# Altium schematic sheet ant_amplifier.SchDoc
size 431 x 279 mm; SheetNumber: 1; SheetTotal: 1
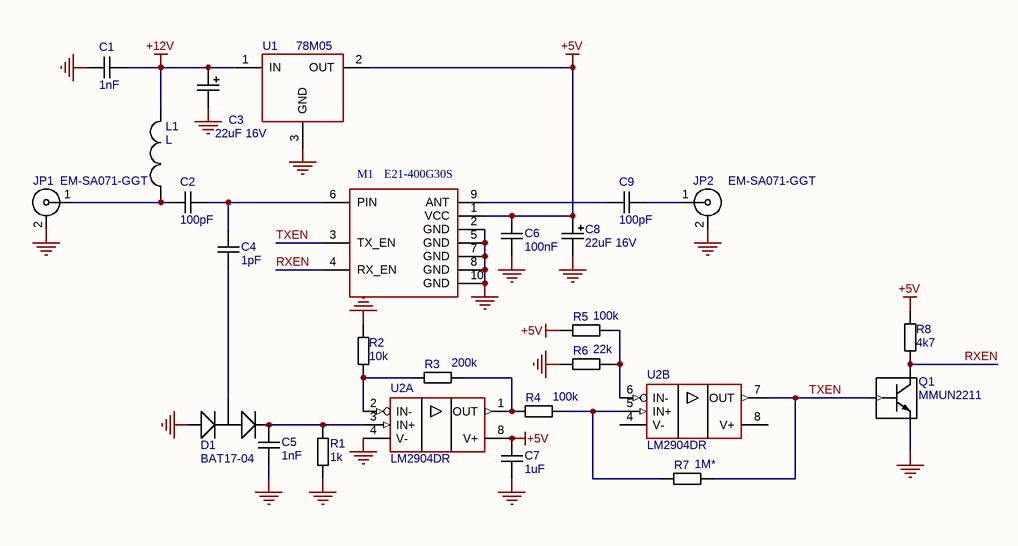
[diagram p0: ant_amplifier.SchDoc]

## Parts
C1  1nF  [C-0603]
C2  100pF  [C-0603]
C3  22uF 16V  [C_TANTAL_B]
C4  1pF  [C-0603]
C5  1nF  [C-0603]
C6  100nF  [C-0603]
C7  1uF  [C-0603]
C8  22uF 16V  [C_TANTAL_B]
C9  100pF  [C-0603]
D1  BAT17-04  [SOT-23]
JP1  EM-SA071-GGT  [SMA_F_EDGE]
JP2  EM-SA071-GGT  [SMA_F_EDGE]
L1  L  [L-1210]
M1  E21-400G30S  [E21]
Q1  MMUN2211  [SOT-23]
R1  1k  [R-0603]
R2  10k  [R-0603]
R3  200k  [R-0603]
R4  100k  [R-0603]
R5  100k  [R-0603]
R6  22k  [R-0603]
R7  1M*  [R-0603]
R8  4k7  [R-0603]
U1  78M05  [DPAK3]
U2  LM2904DR  [SO-8]  (parts A,B of 2)

## Nets
+5V: C6.1 C7.1 C8.2 M1.1(VCC) R5.1 R8.2 U1.2(OUT) U2.8(V+)
+12V: C1.2 C3.2 L1.2 U1.1(IN)
GND: C1.1 C3.1 C5.2 C6.2 C7.2 C8.1 D1.1 JP1.2 JP2.2 M1.2(GND) M1.5(GND) M1.7(GND) M1.8(GND) M1.10(GND) Q1.2(EMITTER) R1.1 R2.2 R6.1 U1.3(GND) U2.4(V-)
RXEN: M1.4(RX_EN) Q1.3(COLLECTOR) R8.1
TXEN: M1.3(TX_EN) Q1.1(BASE) R7.2 U2.7(OUT)
NetC2_1: C2.1 JP1.1 L1.1
NetC2_2: C2.2 C4.1 M1.6(PIN)
NetC4_2: C4.2 D1.3
NetC5_1: C5.1 D1.2 R1.2 U2.3(IN+)
NetC9_1: C9.1 M1.9(ANT)
NetC9_2: C9.2 JP2.1
NetR2_1: R2.1 R3.2 U2.2(IN-)
NetR3_1: R3.1 R4.2 U2.1(OUT)
NetR4_1: R4.1 R7.1 U2.5(IN+)
NetR5_2: R5.2 R6.2 U2.6(IN-)

## Notes on the sheet
- DWG. NO.
- REV.
- SHT.
- THIS DOCUMENT AND THE DATA DISCLOSED HEREIN OR HEREWITH IS THE PROPERTY OF ALTIUM LIMITED AND MAY BE FREELY DISTRIBUTED IN WHOLE. NO RIGHTS ARE RESERVED OR EXPRESS OR IMPLIED WARANTEE GIVEN.
- REVISION
- DESCRIPTION
- DATE
- APPROVED
- ENG:
- APPROVALS
- PROJECT
- DSN:
- CHK:
- REFERENCE DOCUMENTS
- PROJECT REVISION:
- TITLE
- DOCUMENT REVISION:
- DESIGN ITEM:
- BOM:
- FAB DWG:
- PCB DWG:
- ASSY DWG:
- SCALE:
- SIZE
- B
- CAGE CODE
- FILE NAME
- DWG NO.
- SHEET
- OF
- REV

## Library data of the parts
C1 C2 C4-C7 C9 = CAPN: Voltage: 50V; Точність/група: NP0; Вид: Конденсатор
C3 C8 = CAPP: Вид: Конденсатор; Voltage: 16V
D1 = BAT17-04: Вид: Діод
JP1 JP2 = SMA: SMA Female R/A PCB Mount; Вид: Роз'єм
L1 = L: Вид: Індуктивність
M1 = E21
Q1 = MMUN2211: Вид: Транзистор
R1-R8 = RES: Точність/група: 5%; Вид: Резистор
U1 = 78M08: Вид: Мікросхема
U2 = LM2904: Dual Operational Amplifiers, SOIC-8; Вид: Мікросхема